# EasyEDA Pro project ProDoc_方形_2025-04-08.epro

# Schematic 方形板子
Board Name: 方形; Create Date: 2022-12-14; Page Name: P1; Project Name: STM32F103C8T6; Schematic Name: 方形板子; Update Date: 2025-01-19; Company: 嘉立创EDA; Page Size: A4; Version: V1.0
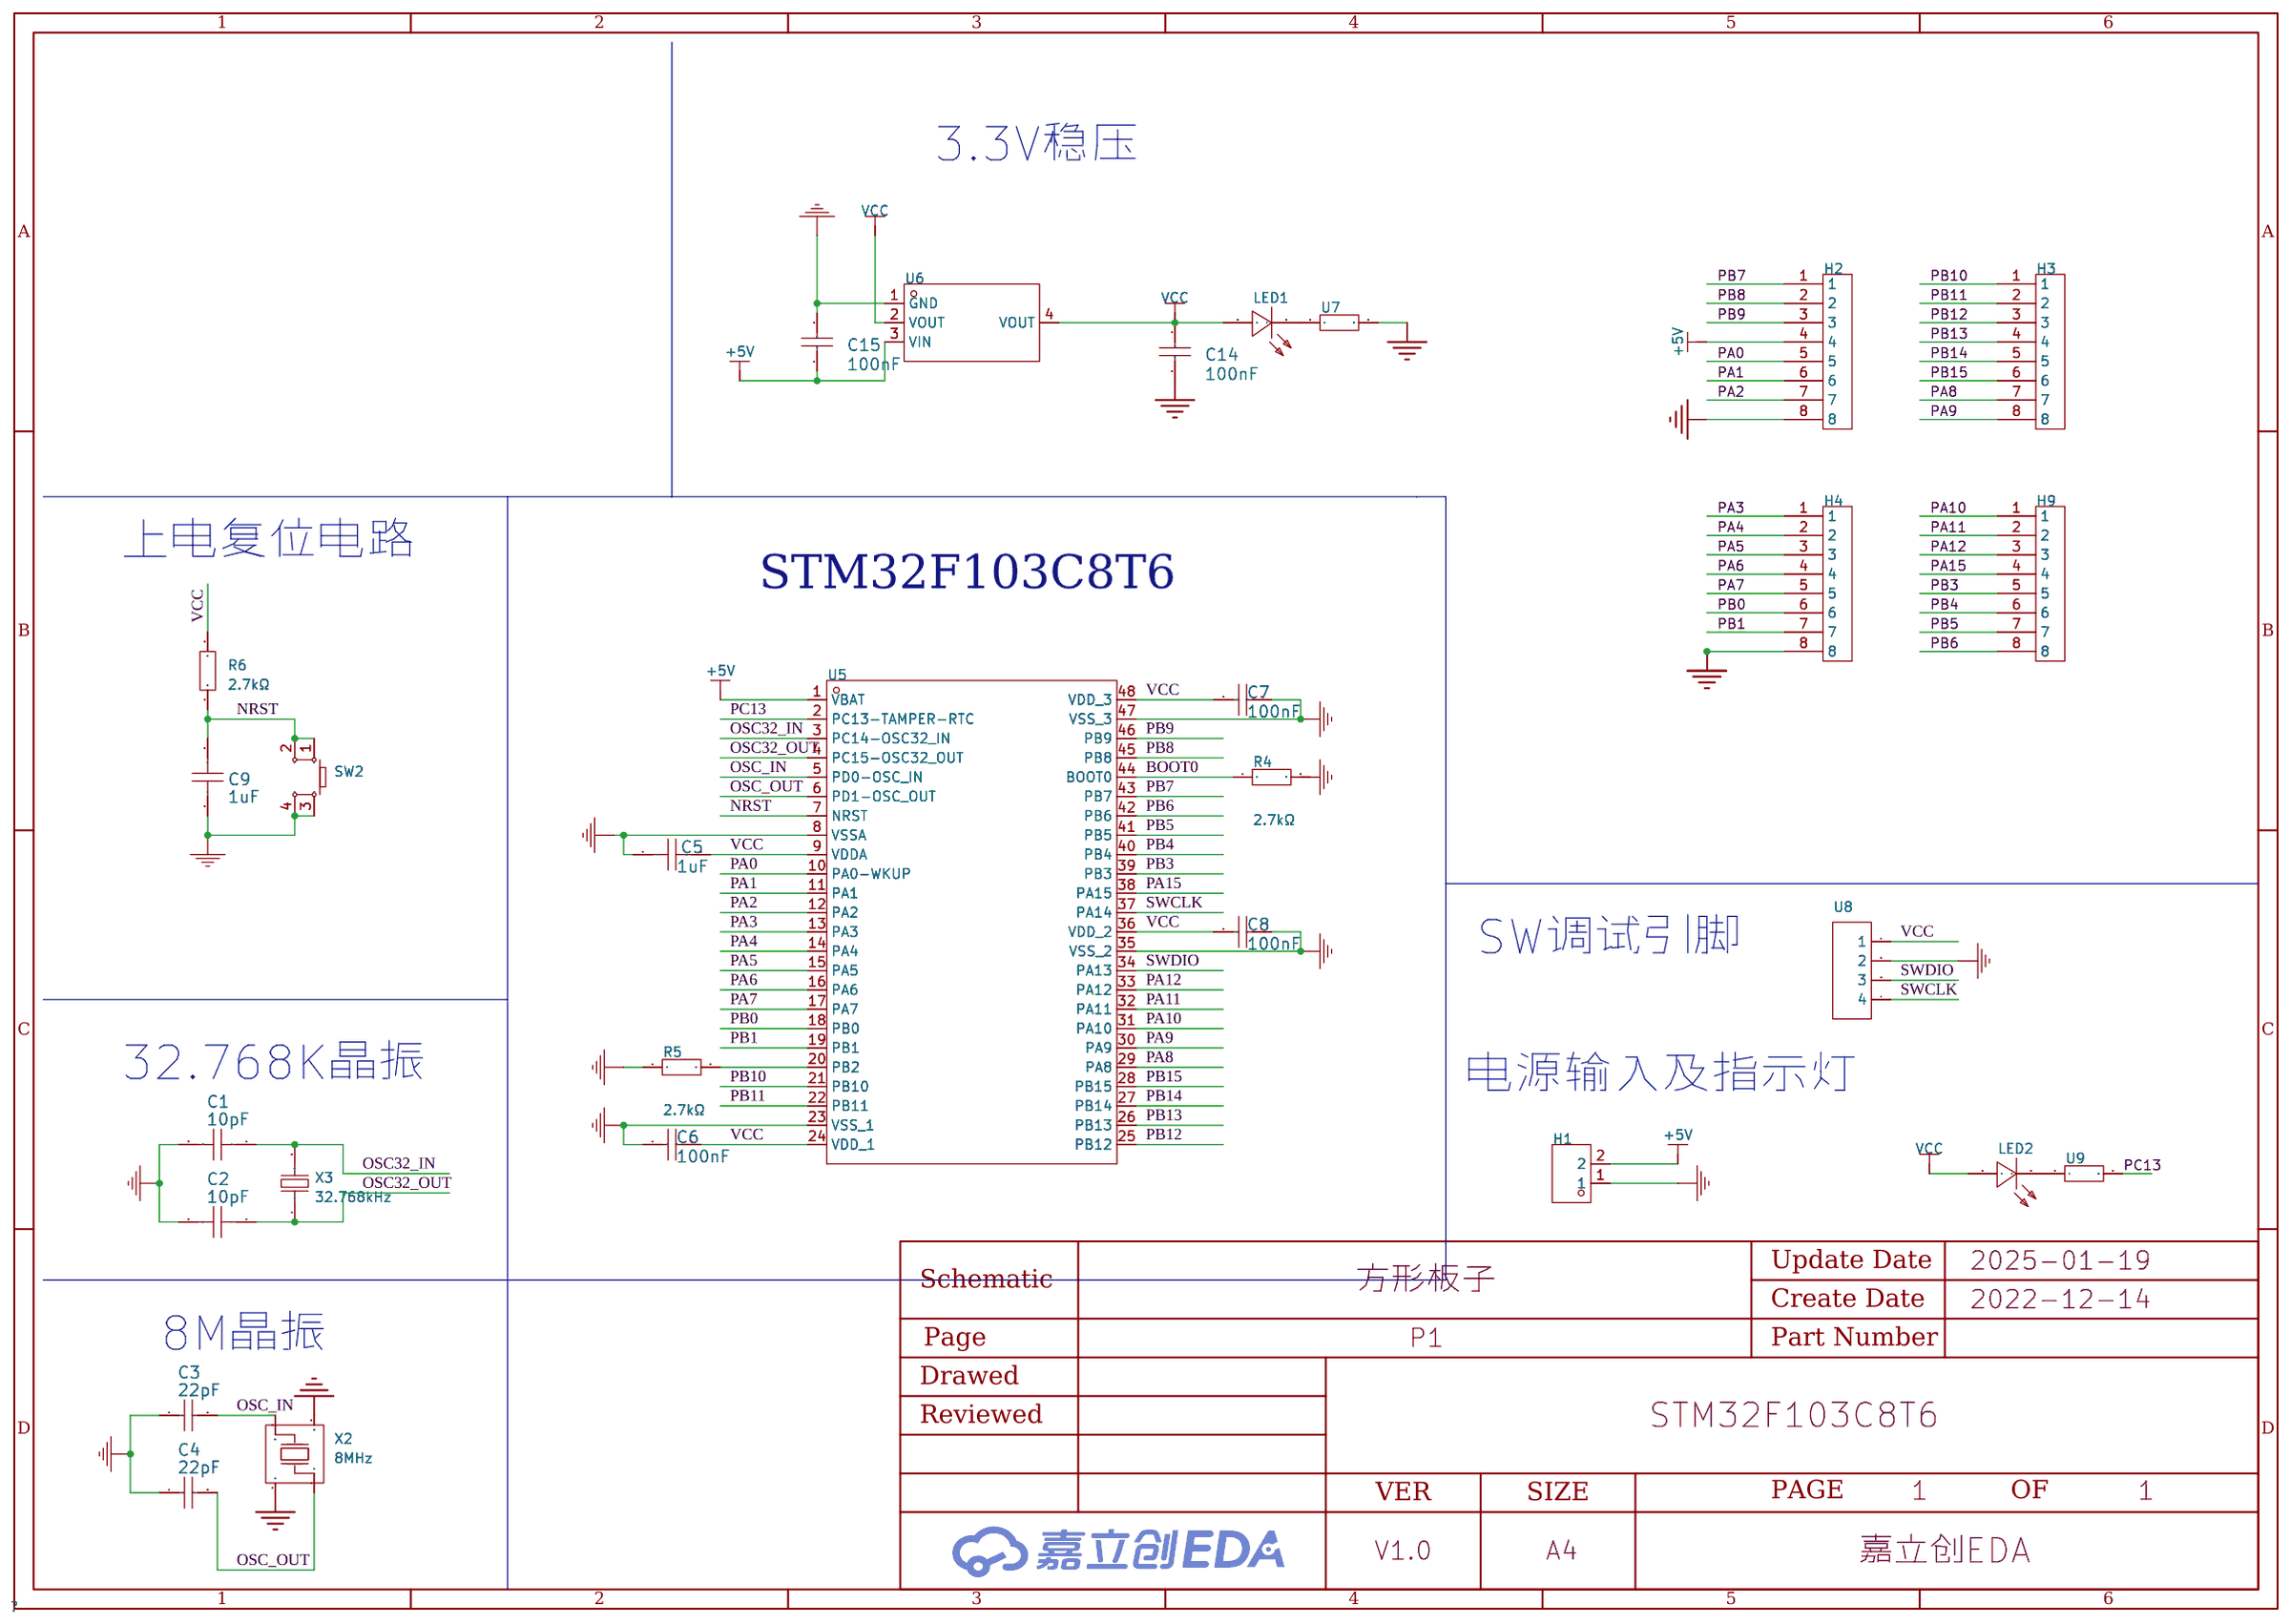
[diagram p0: schematic sheet]

## Parts
C1  10pF  [C0603]
C2  10pF  [C0603]
C3  22pF  [C0603]
C4  22pF  [C0603]
C5  1uF  [C0603]
C6  100nF  [C0603]
C7  100nF  [C0603]
C8  100nF  [C0603]
C9  1uF  [C0603]
C14  100nF  [C0603]
C15  100nF  [C0603]
H1  PZ254V-11-02P  [HDR-TH_2P-P2.54-V-M]
H2  -  [排针8P-直针]
H3  -  [排针8P-直针]
H4  -  [排针8P-直针]
H9  -  [排针8P-直针]
LED1  KT-0603R  [LED0603-RD]
LED2  KT-0603R  [LED0603-RD]
R4  2.7kΩ  [R0603]
R5  2.7kΩ  [R0603]
R6  2.7kΩ  [R0603]
SW2  -  [SW-TH_4P-L6.0-W6.0-P4.50-LS6.5]
U5  STM32F103C8T6  [LQFP-48_L7.0-W7.0-P0.50-LS9.0-BL]
U6  AMS1117-3.3  [SOT-223-3_L6.5-W3.4-P2.30-LS7.0-BR]
U7  贴片电阻_0603_100K_±1%_1/10W  [R0603]
U8  -  [排针/排母4p]
U9  贴片电阻_0603_100K_±1%_1/10W  [R0603]
X2  8MHz  [CRYSTAL-SMD_4P-L3.2-W2.5-BL]
X3  32.768kHz  [FC-135R_L3.2-W1.5]

## Library data of the parts
C1 C2 = 10pF: Supplier: LCSC; Supplier Part: C307356; Manufacturer: Samsung Electro-Mechanics; Manufacturer Part: CL10C100JB81PNC
C3 C4 = 22pF: Supplier: LCSC; Manufacturer Part: CL10C220JB8NNNC; Manufacturer: SAMSUNG; Supplier Part: C1653; JLCPCB Part Class: Basic
C5 C9 = 1uF: Supplier: LCSC; Supplier Part: C466771; Manufacturer: SANYEAR; Manufacturer Part: C0603X5R105K250NT
C6-C8 C14 C15 = 100nF: Supplier: LCSC; Manufacturer Part: 0603B104K160; Manufacturer: WTC; Supplier Part: C80516
H1 = PZ254V-11-02P: 插针结构:1x2P;间距:2.54mm;行距:-;圆针/方针:方针;安装类型:直插;排数:单排;总PIN位数:2P;额定电流:-;额定电压:-;配合针长度:6mm;塑高:2.5mm;端接针长度:3mm;触头材质:黄铜;触头镀层:-;工作温度范围:-40℃~+105℃;颜色:黑色;; LCSC Part Name: 间距:2.54mm 1x2P 直插 方针; Supplier Part: C492401; Manufacturer: XFCN(兴飞); Supplier Footprint: 插件,P=2.54mm; JLCPCB Part Class: 扩展库; Datasheet: https://atta.szlcsc.com/upload/public/pdf/source/20200309/C492401_A812433581A9B211A7FFA413ADDFF0E5.pdf; Supplier: LCSC; Pin Structure: 1x2P; Pitch: 2.54mm; Circluar Pins/Square Pins: 方针; Mounting Type: 直插; Number of Rows: 单排; Number of Pins: 2P; Length of Mating Pin: 6mm; Insulation Height: 2.5mm; Length of End Connection Pin: 3mm; Contact Material: 黄铜; Operating Temperature Range: -40℃~+105℃; Color: 黑色
H2-H4 H9 = 排针8P-直针
LED1 LED2 = KT-0603R: 发光颜色:红色;功率:-;正向电流:-;主波长:-;二极管配置:-;透镜颜色:-;色温:-;发光角度:-;载带方式:-;工作温度:-40℃~+85℃;; LCSC Part Name: 0603 红灯 高亮; Supplier Part: C2286; Manufacturer: KENTO; Supplier Footprint: 0603; JLCPCB Part Class: Basic Part; Datasheet: https://atta.szlcsc.com/upload/public/pdf/source/20160616/1466072038404.pdf; Supplier: LCSC; Emitted Color: 红色; Operating Temperature: -40℃~+85℃
R4-R6 = 电阻0603: 电阻类型:厚膜电阻;阻值:2.7kΩ;精度:±1%;功率:100mW;温度系数:±100ppm/℃;最大工作电压:75V;工作温度范围:-55℃~+155℃;; LCSC Part Name: 2.7kΩ ±1% 100mW; Supplier Part: C13167; Manufacturer: UNI-ROYAL(厚声); Manufacturer Part: 0603WAF2701T5E; Supplier Footprint: 0603; JLCPCB Part Class: Basic Part; Datasheet: https://atta.szlcsc.com/upload/public/pdf/source/20200306/C422600_1E6D84923E4A46A82E41ADD87F860B5C.pdf; Supplier: LCSC; Type: 厚膜电阻; Tolerance: ±1%; Power(Watts): 100mW; Temperature Coefficient: ±100ppm/℃; Overload Voltage (Max): 75V; Operating Temperature Range: -55℃~+155℃
SW2 = Key_TH_6x6x6: 触点电流:50mA;额定电压(DC):12V;绝缘电阻:100MΩ;电路结构:单刀单掷;安装方式:直插;按钮形状:圆形按钮;按钮/盖帽颜色:黑色;作用力:260gf@±30gf;工作温度:-25℃~+70℃;引脚样式:PC引脚;开关长度:6mm;开关宽度:6mm;开关高度:6mm;带支架:否;; Supplier Part: C2837516; Supplier Footprint: 插件
U5 = STM32F103C8T6: CPU内核:ARM-M3;CPU最大主频:72MHz;应用领域:-;; LCSC Part Name: 主流增强型ARM Cortex-M3 MCU，具有64 KB Flash、72 MHz CPU、电机控制、USB和CAN; Supplier Part: C8734; Manufacturer: ST(意法半导体); Supplier Footprint: LQFP-48(7x7); JLCPCB Part Class: Extended Part; Datasheet: https://atta.szlcsc.com/upload/public/pdf/source/20220812/8363ACEC51AD55ECEB84799464F7CB85.pdf; Supplier: LCSC; CPU Core: ARM-M3; CPU Maximum Speed: 72MHz; Program Storage Size: 64KB; Program Memory Type: FLASH; Number of I/O: 37; ADC (Bit): 12bit; Low Voltage Detection Threshold: 2V~3.6V
U6 = AMS1117-3.3_C6186: 输出类型:固定;最大输入电压:-;输出电压:3.3V;最大输出电流:1A;电源纹波抑制比(PSRR):72dB@(120Hz);输出极性:正极;; LCSC Part Name: 输出3.3V 1A; Supplier Part: C6186; Manufacturer: AMS; Supplier Footprint: SOT-223; JLCPCB Part Class: Basic Part; Datasheet: https://atta.szlcsc.com/upload/public/pdf/source/20180727/C6186_7A095716F0823C02F1997A905E26C086.pdf; Supplier: LCSC; Output Type: 固定; Output Voltage: 3.3V; MAX Output Current: 1A; Power Supply Rejection Ratio (PSRR): 72dB@(120Hz); Dropout Voltage: 1.3V@(800mA); Output Polarity: 正极; Number of Outputs: 1
U7 U9 = 贴片电阻_0603_100K_±1%_1/10W: Supplier Part: C9900009623; JLCPCB Part Class: Extended Part; Supplier: LCSC
U8 = 排针4p
X2 = TAXM8M4RDBCCT2T: 晶振类型:贴片晶振;频率:8MHz;常温频差:±10ppm;负载电容:10pF;频率稳定度(全温):±15ppm;; LCSC Part Name: 8MHz ±10ppm 10pF; Supplier Part: C400090; Manufacturer: YJX(雅晶鑫); Supplier Footprint: SMD3225-4P; JLCPCB Part Class: 扩展库; Datasheet: https://atta.szlcsc.com/upload/public/pdf/source/20190626/C400090_CF95B89E745AFE4EF2E392EF8AC009D6.pdf; Supplier: LCSC; Crystal Type: 贴片晶振; Normal temperature Frequency Tolerance: ±10ppm; Load Capacitor: 10pF; Frequency Stability(Full temperature range): ±15ppm; Equivalent Series Resistance (ESR): 250Ω; Operating Temperature: -40℃~+85℃
X3 = Q13FC13500004_C32346: 晶振类型:贴片晶振;频率:32.768kHz;常温频差:±20ppm;负载电容:12.5pF;; LCSC Part Name: 32.768kHz ±20ppm 12.5pF; Supplier Part: C32346; Manufacturer: EPSON(爱普生); Manufacturer Part: Q13FC13500004; Supplier Footprint: SMD3215-2P; JLCPCB Part Class: 基础库; Datasheet: https://atta.szlcsc.com/upload/public/pdf/source/20240418/0E0FF5F0356BA3753F616001439D1416.pdf; Supplier: LCSC; Crystal Type: 贴片晶振; Normal temperature Frequency Tolerance: ±20ppm; Load Capacitor: 12.5pF; Equivalent Series Resistance (ESR): 70kΩ; Operating Temperature: -40℃~+85℃

## Nets
+5V: C15.2 H1.2 H2.4 U5.1(VBAT) U6.3(VIN)
GND: C1.2 C2.2 C3.1 C4.1 C5.1 C6.1 C7.2 C8.2 C9.1 C14.2 C15.1 H1.1 H2.8 H4.8 R4.2 R5.1 SW2.3 SW2.4 U5.8(VSSA) U5.23(VSS_1) U5.35(VSS_2) U5.47(VSS_3) U6.1(GND) U7.2 U8.2 X2.2 X2.4
VCC: C5.2 C6.2 C7.1 C8.1 C14.1 LED1.2(A) LED2.2(A) R6.2 U5.9(VDDA) U5.24(VDD_1) U5.36(VDD_2) U5.48(VDD_3) U6.2(VOUT) U6.4(VOUT) U8.1
BOOT0: R4.1 U5.44(BOOT0)
NRST: C9.2 R6.1 SW2.1 SW2.2 U5.7(NRST)
OSC32_IN: C1.1 U5.3(PC14-OSC32_IN) X3.2
OSC32_OUT: C2.1 U5.4(PC15-OSC32_OUT) X3.1
OSC_IN: C3.2 U5.5(PD0-OSC_IN) X2.3
OSC_OUT: C4.2 U5.6(PD1-OSC_OUT) X2.1
PA0: H2.5 U5.10(PA0-WKUP)
PA1: H2.6 U5.11(PA1)
PA2: H2.7 U5.12(PA2)
PA3: H4.1 U5.13(PA3)
PA4: H4.2 U5.14(PA4)
PA5: H4.3 U5.15(PA5)
PA6: H4.4 U5.16(PA6)
PA7: H4.5 U5.17(PA7)
PA8: H3.7 U5.29(PA8)
PA9: H3.8 U5.30(PA9)
PA10: H9.1 U5.31(PA10)
PA11: H9.2 U5.32(PA11)
PA12: H9.3 U5.33(PA12)
PA15: H9.4 U5.38(PA15)
PB0: H4.6 U5.18(PB0)
PB1: H4.7 U5.19(PB1)
PB3: H9.5 U5.39(PB3)
PB4: H9.6 U5.40(PB4)
PB5: H9.7 U5.41(PB5)
PB6: H9.8 U5.42(PB6)
PB7: H2.1 U5.43(PB7)
PB8: H2.2 U5.45(PB8)
PB9: H2.3 U5.46(PB9)
PB10: H3.1 U5.21(PB10)
PB11: H3.2 U5.22(PB11)
PB12: H3.3 U5.25(PB12)
PB13: H3.4 U5.26(PB13)
PB14: H3.5 U5.27(PB14)
PB15: H3.6 U5.28(PB15)
PC13: U5.2(PC13-TAMPER-RTC) U9.2
SWCLK: U5.37(PA14) U8.4
SWDIO: U5.34(PA13) U8.3
$1N3841: R5.2 U5.20(PB2)
$1N6341: LED1.1(K) U7.1
$1N7405: LED2.1(K) U9.1

## Notes on the sheet
- 3.3V稳压
- 上电复位电路
- STM32F103C8T6
- SW调试引脚
- 32.768K晶振
- 电源输入及指示灯
- 8M晶振

# Board PCB4
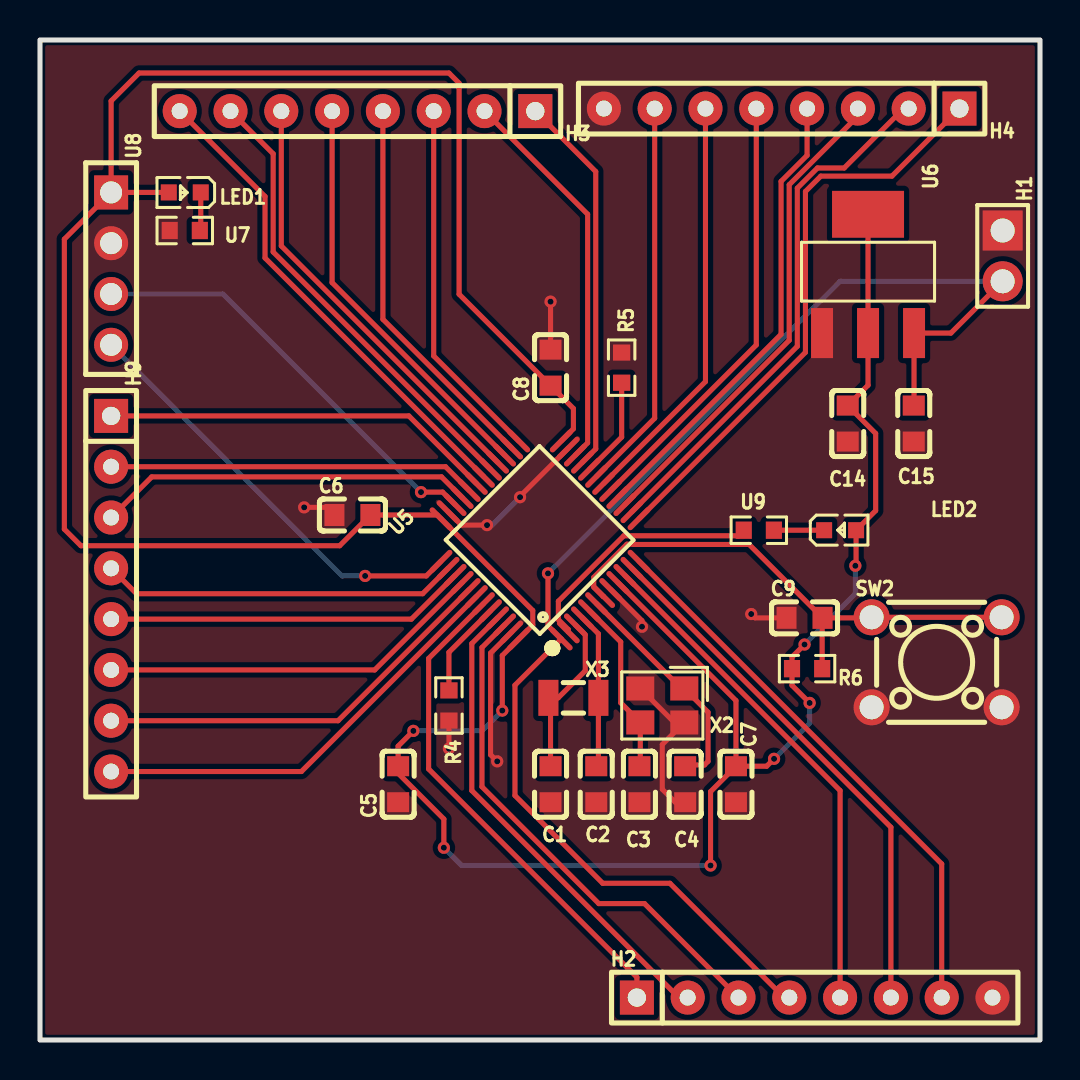
[diagram p1: board, top side]
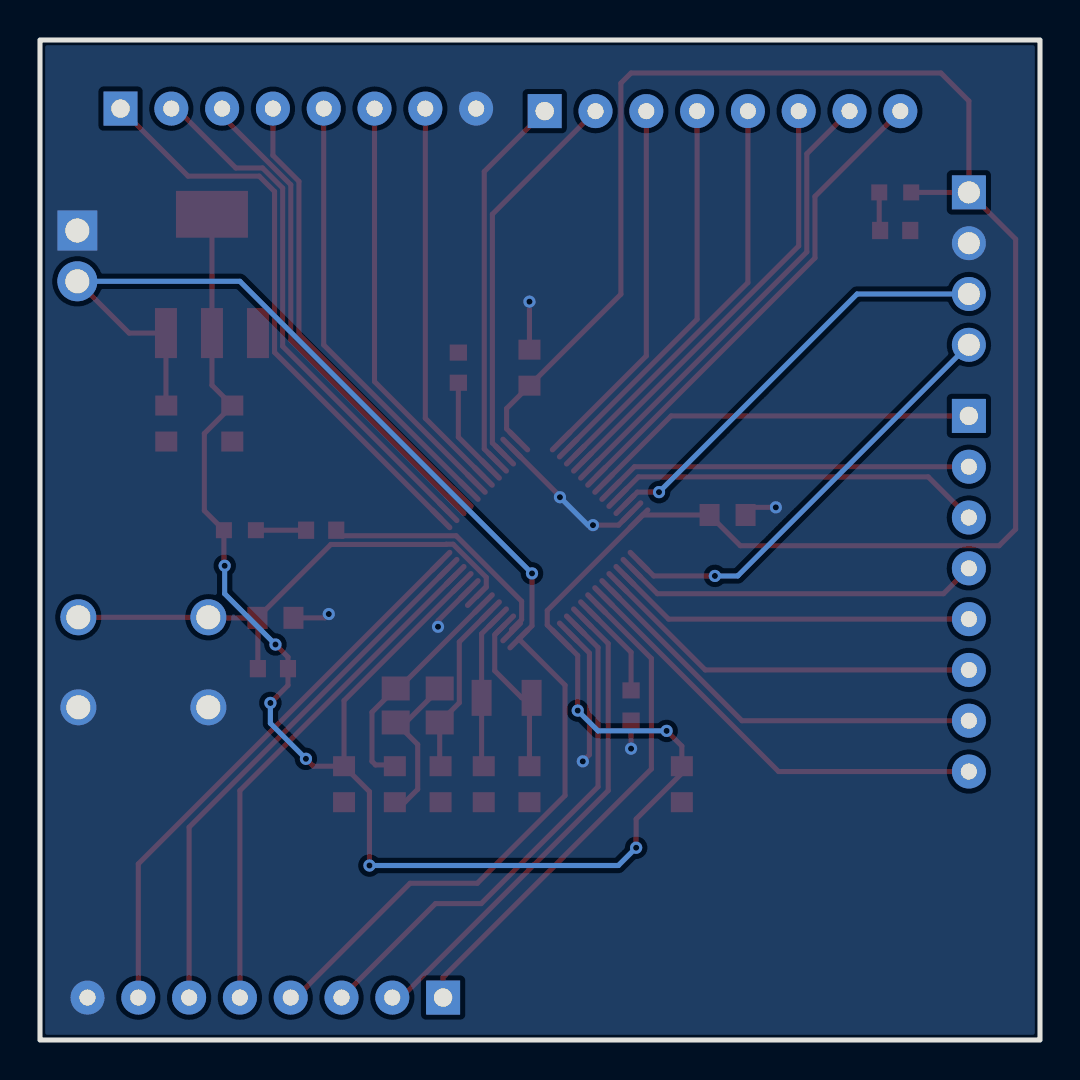
[diagram p2: board, bottom side, seen from below]

Outline 50 x 50 mm; copper layers: Top Layer, Bottom Layer. Coordinates in mm from the lower left corner of the outline.
Outline path: rectangle 0,50 50,0
Stack: Top Layer 0.035mm / Dielectric1 1.51mm FR4 er 4.5 / Bottom Layer 0.035mm

## Design rules (mm)
template: 用户自定义配置
spacing safeClearance (default): track to track 0.152, other pairs 0.152 to 0.3
track width trackWidth (default): min 0.127, default 0.254, max 2.54
differential pair differentialPair (default): width min 0.127, default 0.254, max 2.54; gap min 0.152, default 0.152
via viaSize (default): diameter min 0.5, default 0.61, max 10; hole min 0.3, default 0.305, max 5.999

## Placement (name value [footprint] x y rotation side)
C1  10pF  [C0603]  25.53 12.79 270 top
C2  10pF  [C0603]  27.81 12.79 270 top
C3  22pF  [C0603]  29.97 12.79 90 top
C4  22pF  [C0603]  32.26 12.79 90 top
C5  1uF  [C0603]  17.91 12.79 90 top
C6  100nF  [C0603]  15.62 26.25 0 top
C7  100nF  [C0603]  34.8 12.79 270 top
C8  100nF  [C0603]  25.53 33.62 90 top
C9  1uF  [C0603]  38.23 21.11 0 top
C14  100nF  [C0603]  40.39 30.82 270 top
C15  100nF  [C0603]  43.69 30.82 90 top
H1  PZ254V-11-02P  [HDR-TH_2P-P2.54-V-M]  48.13 39.2 270 top
H2  -  [排针8P-直针]  29.84 2.12 0 top
H3  -  [排针8P-直针]  24.76 46.44 180 top
H4  -  [排针8P-直针]  45.97 46.57 180 top
H9  -  [排针8P-直针]  3.56 31.2 270 top
LED1  KT-0603R  [LED0603-RD]  7.24 42.38 180 top
LED2  KT-0603R  [LED0603-RD]  40 25.49 0 top
R4  2.7kΩ  [R0603]  20.45 16.73 270 top
R5  2.7kΩ  [R0603]  29.08 33.62 270 top
R6  2.7kΩ  [R0603]  38.35 18.57 180 top
SW2  -  [SW-TH_4P-L6.0-W6.0-P4.50-LS6.5]  44.83 18.89 0 top
U5  STM32F103C8T6  [LQFP-48_L7.0-W7.0-P0.50-LS9.0-BL]  25 25 45 top
U6  AMS1117-3.3  [SOT-223-3_L6.5-W3.4-P2.30-LS7.0-BR]  41.4 38.32 270 top
U7  贴片电阻_0603_100K_±1%_1/10W  [R0603]  7.24 40.47 180 top
U8  -  [排针/排母4p]  3.56 38.57 270 top
U9  贴片电阻_0603_100K_±1%_1/10W  [R0603]  35.94 25.49 180 top
X2  8MHz  [CRYSTAL-SMD_4P-L3.2-W2.5-BL]  31.12 16.73 180 top
X3  32.768kHz  [FC-135R_L3.2-W1.5]  26.67 17.11 180 top

## Footprints (pads in the part's own frame, mm; a bottom-side part is the same pattern mirrored in y, then rotated)
C0603
  rect 1x1.1 smd: 1(-0.9,0) 2(0.9,0)
CRYSTAL-SMD_4P-L3.2-W2.5-BL
  rect 1.4x1.2 smd: 1(-1.1,-0.85) 2(1.1,-0.85) 3(1.1,0.85) 4(-1.1,0.85)
FC-135R_L3.2-W1.5
  rect 1x1.8 smd: 1(-1.25,0) 2(1.25,0)
HDR-TH_2P-P2.54-V-M
  rect 2x2 hole 1.2: 1(-1.27,0)
  round 2 hole 1.2: 2(1.27,0)
LED0603-RD
  rect 0.8x0.8 smd: 1(-0.799,0) 2(0.799,0)
LQFP-48_L7.0-W7.0-P0.50-LS9.0-BL
  oval 0.27x1.5 smd: 1(-2.75,-4.25) 2(-2.25,-4.25) 3(-1.75,-4.25) 4(-1.25,-4.25) 5(-0.75,-4.25) 6(-0.25,-4.25) 7(0.25,-4.25) 8(0.75,-4.25) 9(1.25,-4.25) 10(1.75,-4.25) 11(2.25,-4.25) 12(2.75,-4.25) 25(2.75,4.25) 26(2.25,4.25) 27(1.75,4.25) 28(1.25,4.25) 29(0.75,4.25) 30(0.25,4.25) 31(-0.25,4.25) 32(-0.75,4.25) 33(-1.25,4.25) 34(-1.75,4.25) 35(-2.25,4.25) 36(-2.75,4.25)
  oval 1.5x0.27 smd: 13(4.25,-2.75) 14(4.25,-2.25) 15(4.25,-1.75) 16(4.25,-1.25) 17(4.25,-0.75) 18(4.25,-0.25) 19(4.25,0.25) 20(4.25,0.75) 21(4.25,1.25) 22(4.25,1.75) 23(4.25,2.25) 24(4.25,2.75) 37(-4.25,2.75) 38(-4.25,2.25) 39(-4.25,1.75) 40(-4.25,1.25) 41(-4.25,0.75) 42(-4.25,0.25) 43(-4.25,-0.25) 44(-4.25,-0.75) 45(-4.25,-1.25) 46(-4.25,-1.75) 47(-4.25,-2.25) 48(-4.25,-2.75)
R0603
  rect 0.806x0.864 smd: 1(-0.753,0) 2(0.753,0)
SOT-223-3_L6.5-W3.4-P2.30-LS7.0-BR
  rect 2.5x1.1 smd: 1(2.97,-2.3) 2(2.97,0) 3(2.97,2.3)
  rect 2.34x3.6 smd: 4(-2.97,0)
SW-TH_4P-L6.0-W6.0-P4.50-LS6.5
  round 1.8 hole 1.2: 1(-3.25,2.25) 2(3.25,2.25) 3(-3.25,-2.25) 4(3.25,-2.25)
排针8P-直针
  rect 1.7x1.7 hole 0.914x0.8: 1(0,0)
  round 1.7 hole 0.8: 2(2.54,0) 3(5.08,0) 4(7.62,0) 5(10.16,0) 6(12.7,0) 7(15.24,0) 8(17.78,0)
排针/排母4p
  rect 1.7x1.7 hole 1.1: 1(-3.81,0)
  round 1.7 hole 1.1: 2(-1.27,0) 3(1.27,0) 4(3.81,0)

## Nets
As in the schematic.

## Via types
v1: diameter 0.61, hole 0.305, Top Layer to Bottom Layer, 19 vias

## Routing (per net, layer and track width the routed paths; a pad name or vN(x,y) marks a point on that pad's centre or on a via; arc(x,y) is an arc through that point)
+5V: length 68.2
  Top Layer w0.254: C15.2 43.7,31.74 U6.3 45.54,35.35 H1.2 ; H2.4 37.21,2.12 31.5,7.84 28.13,7.84 23.75,12.22 23.75,17.74 26.06,20.05 U5.1 25.4,20.71 v1(25.4,23.33)
  Bottom Layer w0.254: H1.2 40,37.94 v1(25.4,23.33)
GND: length 32.9
  Top Layer w0.254: R4.2 v1(20.45,14.57) ; C4.1 31.76,11.89 31.12,12.53 31.12,14.78 X2.4 31.72,15.88 X2.2 ; v1(30.1,20.66) 30.1,20.96 28.54,22.53 ; v1(22.35,25.74) 21.07,25.74 U5.35 ; v1(24,27.14) 24,27.19 U5.23 ; v1(13.21,26.63) 14.34,26.63 C6.1 ; U5.47 22.53,19.35 22.53,14.26 v1(22.86,13.93) ; C9.1 35.75,21.11 v1(35.56,21.3) ; C8.2 v1(25.53,36.92)
  Bottom Layer w0.254: v1(22.35,25.74) 22.61,25.74 v1(24,27.14)
VCC: length 171.9
  Top Layer w0.254: C7.1 34.8,16.97 28.89,22.88 ; C7.1 36.33,13.69 v1(36.7,14.06) ; C7.1 33.53,12.42 v1(33.53,8.72) ; U5.24 26.67,30.56 26.67,31.57 C8.1 20.96,37.29 20.96,47.84 20.45,48.35 4.95,48.35 3.56,46.95 U8.1 ; v1(38.23,19.77) 37.6,19.15 R6.2 37.6,17.73 v1(38.48,16.85) ; U8.1 1.22,40.04 1.22,25.54 2.05,24.71 14.98,24.71 16.52,26.25 19.86,26.25 U5.36 24.64,21.47 24.64,20.75 U5.48 23.11,19.22 v1(23.11,16.47) ; U8.1 LED1.2 ; U6.4 U6.2 41.4,32.74 C14.1 41.78,30.33 41.78,26.47 LED2.2 40.8,23.75 v1(40.77,23.71) ; v1(20.19,9.61) 20.19,11.05 17.91,13.33 C5.2 17.91,14.69 v1(18.67,15.46)
  Bottom Layer w0.254: v1(40.77,23.71) 40.77,22.31 v1(38.23,19.77) ; v1(36.7,14.06) 38.48,15.84 v1(38.48,16.85) ; v1(20.19,9.61) 21.08,8.72 v1(33.53,8.72) ; v1(18.67,15.46) 22.1,15.46 v1(23.11,16.47)
BOOT0: length 4.8
  Top Layer w0.254: R4.1 20.45,19.39 22.53,21.46
NRST: length 26.3
  Top Layer w0.254: U5.7 28.16,22.17 27.69,22.64 27.69,23.13 29.34,24.79 29.69,24.79 29.7,24.78 35.46,24.78 C9.2 ; C9.2 39.11,21.09 R6.1 ; C9.2 41.55,21.11 SW2.1 SW2.2
OSC32_IN: length 8.4
  Top Layer w0.254: U5.3 27.26,20.26 27.26,18.46 25.91,17.11 X3.2 25.53,17 C1.1
OSC32_OUT: length 7.8
  Top Layer w0.254: 27.12,21.11 27.92,20.31 X3.1 27.92,13.8 C2.1
OSC_IN: length 8.8
  Top Layer w0.254: C3.2 30.01,13.73 X2.3 29.04,16.86 29.04,19.9 27.47,21.46
OSC_OUT: length 11.5
  Top Layer w0.254: C4.2 32.32,13.75 33.22,13.75 33.4,13.93 33.4,16.39 X2.1 32.07,17.58 U5.6
PA0: length 25.6
  Top Layer w0.254: U5.10 40,12.47 H2.5
PA1: length 26.8
  Top Layer w0.254: H2.6 42.54,10.64 U5.11
PA2: length 28.1
  Top Layer w0.254: U5.12 45.09,8.8 H2.7
PA3: length 29.2
  Top Layer w0.254: H4.1 42.6,43.19 39.04,43.19 38.27,42.43 38.27,34.38 U5.13
PA4: length 26.8
  Top Layer w0.254: H4.2 43.18,46.57 40.21,43.6 38.87,43.6 37.87,42.59 37.87,34.68 U5.14
PA5: length 24.6
  Top Layer w0.254: H4.3 40.89,46.2 37.46,42.76 37.46,34.98 U5.15
PA6: length 23.4
  Top Layer w0.254: 28.89,27.12 37.05,35.29 37.05,42.93 38.35,44.23 H4.4
PA7: length 22.1
  Top Layer w0.254: H4.5 35.81,34.75 28.54,27.47
PA8: length 23.3
  Top Layer w0.254: 22.53,28.54 11.66,39.4 11.66,44.31 H3.7
PA9: length 24.6
  Top Layer w0.254: U5.30 11.25,39.1 11.25,42.18 H3.8
PA10: length 19.7
  Top Layer w0.254: U5.31 18.44,31.2 H9.1
PA11: length 18.4
  Top Layer w0.254: H9.2 20.28,28.66 21.46,27.47
PA12: length 18.8
  Top Layer w0.254: H9.3 5.59,28.16 20.08,28.16 21.11,27.12
PA15: length 17.9
  Top Layer w0.254: H9.4 4.83,22.31 19.13,22.31 U5.38
PB0: length 20.9
  Top Layer w0.254: U5.18 33.27,32.92 H4.6
PB1: length 19.6
  Top Layer w0.254: H4.7 30.73,31.09 U5.19
PB3: length 18.1
  Top Layer w0.254: H9.5 18.57,21.04 U5.39
PB4: length 19.4
  Top Layer w0.254: H9.6 16.74,18.5 21.11,22.88
PB5: length 20.6
  Top Layer w0.254: 21.46,22.53 14.9,15.96 H9.7
PB6: length 21.9
  Top Layer w0.254: U5.42 13.07,13.42 H9.8
PB7: length 25.1
  Top Layer w0.254: U5.43 19.43,19.08 19.43,13.55 29.84,3.14 H2.1
PB8: length 24.3
  Top Layer w0.254: H2.2 31.94,2.12 21.59,12.47 21.59,19.82 22.88,21.11
PB9: length 25.8
  Top Layer w0.254: U5.46 22.1,19.62 22.1,12.66 27.94,6.82 30.23,6.82 H2.3
PB10: length 19.1
  Top Layer w0.254: 27.12,28.89 27.79,29.56 27.79,43.42 H3.1
PB11: length 19.6
  Top Layer w0.254: H3.2 27.38,41.29 27.38,29.86 U5.22
PB12: length 18.3
  Top Layer w0.254: U5.25 19.69,34.2 H3.3
PB13: length 19.5
  Top Layer w0.254: U5.26 17.15,36.04 H3.4
PB14: length 20.8
  Top Layer w0.254: U5.27 14.6,37.87 H3.5
PB15: length 22
  Top Layer w0.254: 22.88,28.89 12.06,39.7 H3.6
PC13: length 12.5
  Top Layer w0.254: U9.2 34.91,25.21 29.19,25.21 25.92,21.94 25.92,21.02 26.41,20.53 U5.2
SWCLK: length 21.6
  Top Layer w0.254: v1(16.26,23.2) 19.31,23.2 U5.37
  Bottom Layer w0.254: U8.4 15.11,23.2 v1(16.26,23.2)
SWDIO: length 21.6
  Top Layer w0.254: U5.34 20.13,27.39 v1(19.05,27.39)
  Bottom Layer w0.254: v1(19.05,27.39) 9.14,37.3 U8.3
$1N3841: length 5
  Top Layer w0.254: 27.47,28.54 29.08,30.14 R5.2
$1N6341: length 1.9
  Top Layer w0.254: LED1.1 8.04,40.52 U7.1
$1N7405: length 2.5
  Top Layer w0.254: U9.1 LED2.1

## Copper pours and planes (outline as drawn; the poured copper is in the pictures)
GND on Top Layer: -5.46,53.68 57.15,53.68 57.15,-6.01 -5.46,-6.01
GND on Bottom Layer: -5.72,53.94 56.13,53.94 56.13,-5.12 -5.72,-5.12
